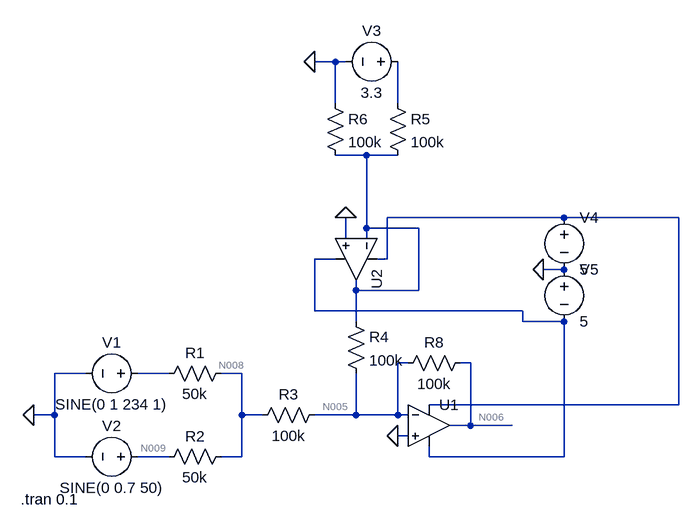
[diagram p0: schematic AuxAdderInverterCircuit-Modified.asc]
AuxAdderInverterCircuit-Modified.asc, the LTspice schematic file:
Version 4
SHEET 1 916 680
WIRE 384 -336 352 -336
WIRE 400 -336 384 -336
WIRE 384 -272 384 -336
WIRE 480 -272 480 -336
WIRE 432 -192 384 -192
WIRE 480 -192 432 -192
WIRE 736 -96 464 -96
WIRE 912 -96 736 -96
WIRE 432 -80 432 -192
WIRE 512 -80 432 -80
WIRE 400 -64 400 -96
WIRE 432 -64 432 -80
WIRE 384 -32 352 -32
WIRE 464 -32 464 -96
WIRE 464 -32 448 -32
WIRE 736 -16 704 -16
WIRE 416 16 416 0
WIRE 512 16 512 -80
WIRE 512 16 416 16
WIRE 352 48 352 -32
WIRE 672 48 352 48
WIRE 416 64 416 16
WIRE 672 64 672 48
WIRE 736 64 672 64
WIRE 496 128 480 128
WIRE 592 128 576 128
WIRE 0 144 -48 144
WIRE 128 144 80 144
WIRE 240 144 208 144
WIRE 912 192 912 -96
WIRE 912 192 528 192
WIRE -48 208 -48 144
WIRE -48 208 -80 208
WIRE 240 208 240 144
WIRE 272 208 240 208
WIRE 416 208 416 144
WIRE 416 208 352 208
WIRE 480 208 480 128
WIRE 480 208 416 208
WIRE 496 208 480 208
WIRE 592 224 592 128
WIRE 592 224 560 224
WIRE 656 224 592 224
WIRE 496 240 480 240
WIRE -48 272 -48 208
WIRE 0 272 -48 272
WIRE 128 272 80 272
WIRE 240 272 240 208
WIRE 240 272 208 272
WIRE 528 272 528 256
WIRE 736 272 736 64
WIRE 736 272 528 272
FLAG -80 208 0
FLAG 480 240 0
FLAG 352 -336 0
FLAG 400 -96 0
FLAG 704 -16 0
SYMBOL voltage 96 144 R90
WINDOW 0 -32 56 VBottom 2
WINDOW 3 32 56 VTop 2
WINDOW 123 0 0 Left 0
WINDOW 39 0 0 Left 0
SYMATTR InstName V1
SYMATTR Value SINE(0 1 234 1)
SYMBOL voltage 96 272 R90
WINDOW 0 -32 56 VBottom 2
WINDOW 3 32 56 VTop 2
WINDOW 123 0 0 Left 0
WINDOW 39 0 0 Left 0
SYMATTR InstName V2
SYMATTR Value SINE(0 0.7 50)
SYMBOL res 224 128 R90
WINDOW 0 0 56 VBottom 2
WINDOW 3 32 56 VTop 2
SYMATTR InstName R1
SYMATTR Value 50k
SYMBOL res 224 256 R90
WINDOW 0 0 56 VBottom 2
WINDOW 3 32 56 VTop 2
SYMATTR InstName R2
SYMATTR Value 50k
SYMBOL res 368 192 R90
WINDOW 0 0 56 VBottom 2
WINDOW 3 32 56 VTop 2
SYMATTR InstName R3
SYMATTR Value 100k
SYMBOL OpAmps\\UniversalOpAmp 528 224 R0
SYMATTR InstName U1
SYMBOL res 464 -288 R0
SYMATTR InstName R5
SYMATTR Value 100k
SYMBOL res 368 -288 R0
SYMATTR InstName R6
SYMATTR Value 100k
SYMBOL voltage 496 -336 R90
WINDOW 0 -32 56 VBottom 2
WINDOW 3 32 56 VTop 2
WINDOW 123 0 0 Left 0
WINDOW 39 0 0 Left 0
SYMATTR InstName V3
SYMATTR Value 3.3
SYMBOL res 480 144 R270
WINDOW 0 32 56 VTop 2
WINDOW 3 0 56 VBottom 2
SYMATTR InstName R8
SYMATTR Value 100k
SYMBOL OpAmps\\UniversalOpAmp 416 -32 R90
SYMATTR InstName U2
SYMBOL res 400 48 R0
SYMATTR InstName R4
SYMATTR Value 100k
SYMBOL voltage 736 -112 R0
WINDOW 123 0 0 Left 0
WINDOW 39 0 0 Left 0
SYMATTR InstName V4
SYMATTR Value 5
SYMBOL voltage 736 -32 R0
WINDOW 123 0 0 Left 0
WINDOW 39 0 0 Left 0
SYMATTR InstName V5
SYMATTR Value 5
TEXT -100 338 Left 2 !.tran 0.1

The netlist it stands for:
* AuxAdderInverterCircuit-Modified.asc
V1 N007 0 SINE(0 1 234 1)
V2 N009 0 SINE(0 0.7 50)
R1 N008 N007 50k
R2 N008 N009 50k
R3 N005 N008 100k
XU1 0 N005 N003 N004 N006 level1 Avol=1Meg GBW=10Meg Vos=0 En=0 Enk=0 In=0 Ink=0 Rin=500Meg  ; pins In+ In- V+ V- OUT
R5 N001 N002 100k
R6 0 N002 100k
V3 N001 0 3.3
R8 N005 N006 100k
XU2 0 N002 N003 N004 N002 level1 Avol=1Meg GBW=10Meg Vos=0 En=0 Enk=0 In=0 Ink=0 Rin=500Meg  ; pins In+ In- V+ V- OUT
R4 N002 N005 100k
V4 N003 0 5
V5 0 N004 5
.tran 0.1
.lib UniversalOpAmp1.lib
.backanno
.end

* Results of the author's LTspice run, read from the files saved beside the schematic
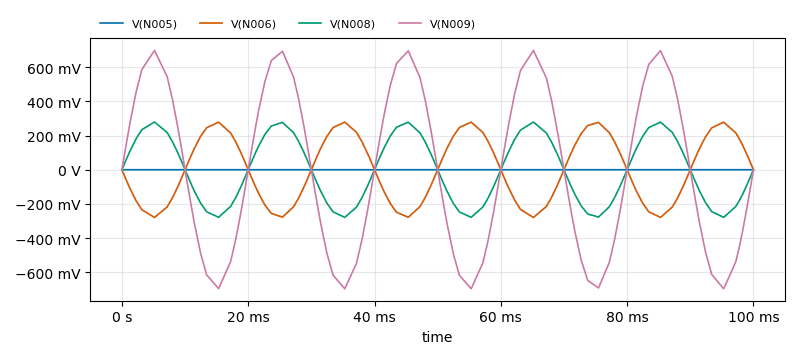
[diagram p1: Transient Analysis of AuxAdderInverterCircuit-Modified.asc, plotted from the saved traces]
* Transient Analysis, 1 run:
*   V(N005): min -1.425 µV, max 2.096 µV, average -140.2 pV, rms 1.025 µV, last 1.4 µV
*   V(N006): min -279.3 mV, max 278.6 mV, average 131.3 µV, rms 194.8 mV, last 3.921 µV
*   V(N008): min -278.6 mV, max 279.3 mV, average -131.3 µV, rms 194.8 mV, last 280.1 nV
*   V(N009): min -696.7 mV, max 698.5 mV, average -328.4 µV, rms 487.1 mV, last 0 V